# Altium project power_protection_board.PrjPcb
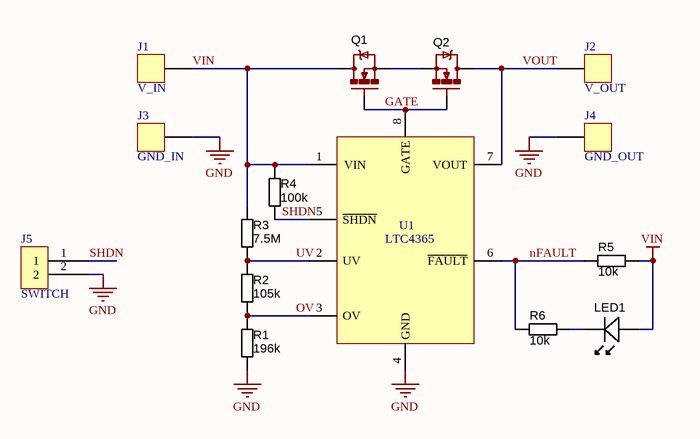
[diagram p0: power_protection_board.SchDoc]
1 sheet, 15 parts. Net scope: global (net labels, ports and power ports of the same name join across sheets).
Board file: power_protection_board.PcbDoc

## Sheet power_protection_board.SchDoc
size A4

### Parts
J1  V_IN  [POWER-PAD]
J2  V_OUT  [POWER-PAD]
J3  GND_IN  [POWER-PAD]
J4  GND_OUT  [POWER-PAD]
J5  SWITCH  [PADS-2-1020]
LED1  (no value)  [LED-0603-GREEN]
Q1  MOSFET-N  [SOT669]  (value not drawn)
Q2  MOSFET-N  [SOT669]  (value not drawn)
R1  196k  [RESC1608X55N]
R2  105k  [RESC1608X55N]
R3  7.5M  [RESC1608X55N]
R4  100k  [RESC1608X55N]
R5  10k  [RESC1608X55N]
R6  10k  [RESC1608X55N]
U1  LTC4365  [SOT23-8]

### Nets
GND: J3.1 J4.1 J5.2 R1.1 U1.4(GND)
VIN: J1.1 LED1.A Q1.D R3.2 R4.2 R5.2 U1.1(VIN)
GATE: Q1.G Q2.G U1.8(GATE)
nFAULT: R5.1 R6.1 U1.6(~{FAULT})
OV: R1.2 R2.1 U1.3(OV)
SHDN: J5.1 R4.1 U1.5(~{SHDN})
UV: R2.2 R3.1 U1.2(UV)
VOUT: J2.1 Q2.D U1.7(VOUT)
NetLED1_K: LED1.K R6.2
NetQ1_S: Q1.S Q2.S

### Library data of the parts
J1-J4 = HEADER-1
J5 = HEADER-2
LED1 = LED_SMD_Green_0603_525nm_350mcd: LED 0603 SMD Green 525nm 350mcd 20mA; Manufacturer 1: Kingbright; Manufacturer Part Number 1: APT1608ZGCK; Material: InGaN; Ratings: 200mcd min; 350 mcd typ @ 20mA; Voltage - Forward (Vf) @ 10mA: 3.1V; Viewing Angle: 120°; Lens Style/Size: Rectangle with Flat Top, 1.2mm x 0.8mm; Voltage - Forward (Vf) @ 20mA: 3.3V; SCDType: source; Package / Case: 0603 (1608 metric); Color: Green; Current - Test: 20mA; Manufacturer 2: Kingbright Company LLC; Manufacturer Part Number 2: APT1608-WAP24; Supplier 1: Mouser; Supplier Part Number 1: 604-APT1608ZGCK; ComponentLink1URL: http://www.mouser.com/ds/2/216/APT1608ZGCK-262051.pdf; ComponentLink1Description: http://www.mouser.com/ds/2/216/APT1608ZGCK-262051.pdf; ComponentLink2Description: APT1608-WAP24 Datasheet; ComponentLink2URL: \\SVFI2\PBLShare\Eng\Electrical Engineering\Hardware\Altium\Libraries and Templates\Unreleased Components\Part Number Request 2013-10-02\APT1608-WAP24(Ver.1B).pdf
Q1 Q2 = MOSFET-N: PROD_ID: IC-08089
R1-R6 = RES_1K5_0603_5%: Resistor SMD chip 1.5k Ohm 0.1W 5% 0603; Manufacturer 1: Yageo; Manufacturer Part Number 1: RC0603JR-071K5L; Ratings: 1/10 W; Value: 1K5; SCDType: spec; Package / Case: 0603 (1608 metric); Tolerance: ±5%; Material: thick film; Supplier 1: Digi-Key; Supplier Part Number 1: 311-1.5KGRCT-ND